# EAGLE design chest_03_12_2018 (EAGLE 6.6.0)
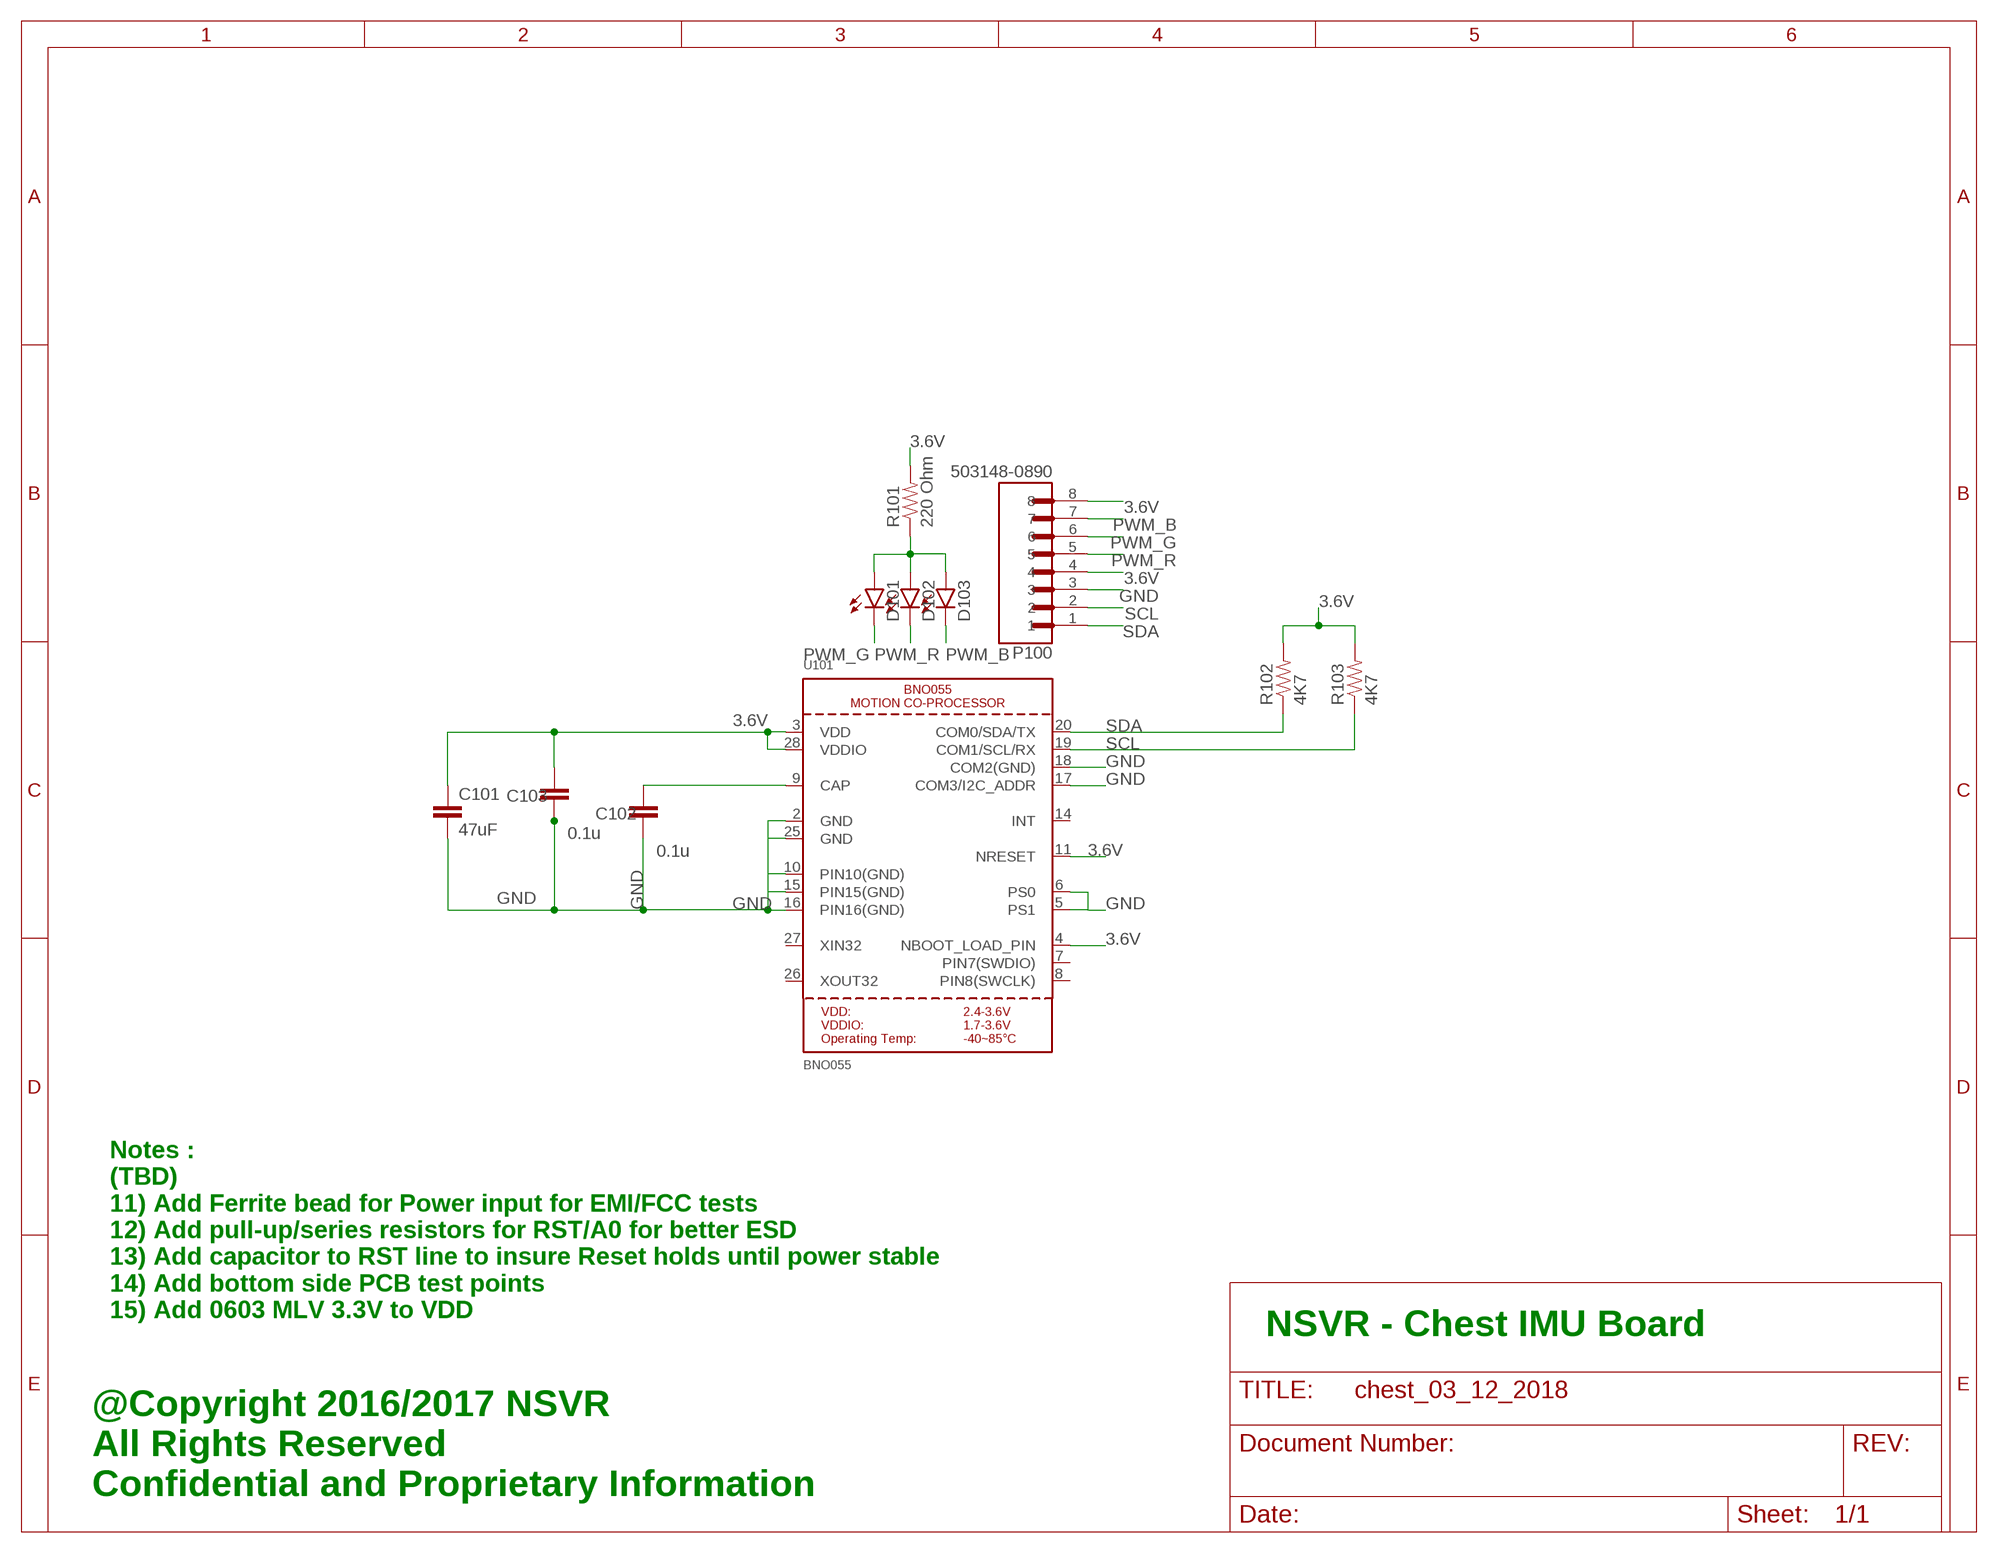
[diagram p0: schematic, sheet 1]

## Parts
C101  47uF  CAP1206  [1206]
C102  0.1u  CAP0402-CAP  [0402-CAP]
C103  0.1u  CAP0402-CAP  [0402-CAP]
D101  LED0603  [LED-0603]
D102  LED0603  [LED-0603]
D103  LED0603  [LED-0603]
P100  503148-0890  [MOLEX_503148-0890]
R101  220 Ohm  RESISTOR0402-TYP  [EIA-0402]
R102  4K7  RESISTOR0402-TYP  [EIA-0402]
R103  4K7  RESISTOR0402-TYP  [EIA-0402]
U101  BNO055  [BNO055]

## Nets
3.6V: C101.1 C103.1 P100.4 P100.8 R101.2 R102.2 R103.2 U101.3(VDD) U101.4(NBOOT_LOAD_PIN) U101.11(NRESET) U101.28(VDDIO)
BYPASS: C102.1 U101.9(CAP)
GND: C101.2 C102.2 C103.2 P100.3 U101.2(GND) U101.5(PS1) U101.6(PS0) U101.10(PIN10(GND)) U101.15(PIN15(GND)) U101.16(PIN16(GND)) U101.17(COM3/I2C_ADDR) U101.18(COM2(GND)) U101.25(GND)
N$1: D101.A D102.A D103.A R101.1
PWM_B: D103.C P100.7
PWM_G: D101.C P100.6
PWM_R: D102.C P100.5
SCL: P100.2 R103.1 U101.19(COM1/SCL/RX)
SDA: P100.1 R102.1 U101.20(COM0/SDA/TX)
Unconnected: U101.7(PIN7(SWDIO)) U101.8(PIN8(SWCLK)) U101.14(INT) U101.26(XOUT32) U101.27(XIN32)

## Notes on the sheet
- Notes :
  (TBD)
  11) Add Ferrite bead for Power input for EMI/FCC tests
  12) Add pull-up/series resistors for RST/A0 for better ESD
  13) Add capacitor to RST line to insure Reset holds until power stable
  14) Add bottom side PCB test points
  15) Add 0603 MLV 3.3V to VDD
- NSVR - Chest IMU Board
- @Copyright 2016/2017 NSVR
  All Rights Reserved
  Confidential and Proprietary Information

## Library data of the parts
C101-C103 = PatternAgents-ProtoPads:CAP: Capacitor Standard 0603 ceramic capacitor, and 0.1" leaded capacitor.
D101-D103 = SparkFun-LED:LED: LEDs Standard schematic elements and footprints for 5mm, 3mm, 1206, and 0603 sized LEDs. 5mm - Spark Fun Electronics SKU : COM-00529 (and others)
P100 = 503148-0890:503148-0890: 1.5wb Dual r/a Embs Tape Pkg 8p; AVAILABILITY: Good; DESCRIPTION: 1.5wb Dual r/a Embs Tape Pkg 8p; MF: Molex; MP: 503148-0890; PACKAGE: None; PRICE: 1.11 USD
R101-R103 = PatternAgents-ProtoPads:RESISTOR: Resistor Basic schematic elements and footprints for 0603, 1206, and PTH resistors.
U101 = microbuilder:BNO055: BNO055 - Motion Co-Processor

## Board
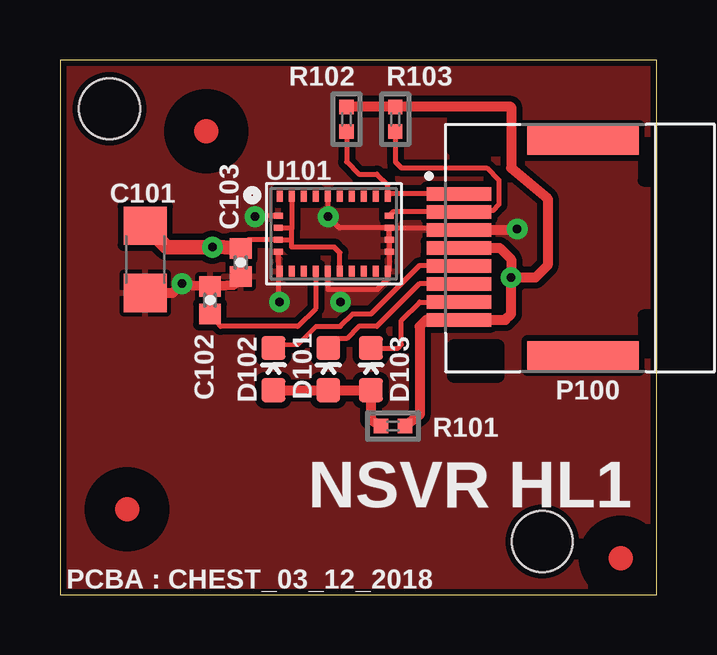
[diagram p1: board, top side]
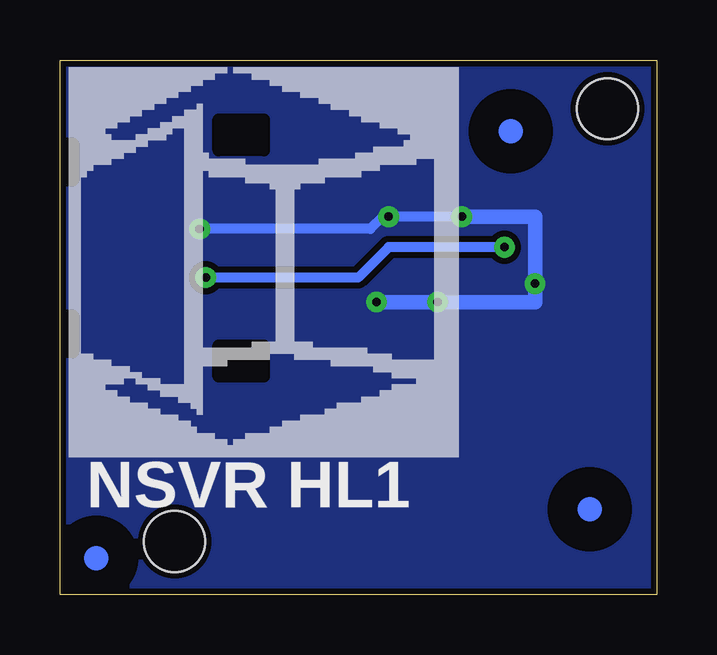
[diagram p2: board, bottom side, seen from below]

Size 24.87 x 22.28 mm. Coordinates in mm from the lower left corner, seen from the top.
Outline: 0,0 24.87,0 24.87,22.28 0,22.28 0,0
Copper layers (1*16): Top 0.035mm / dielectric 1.5mm / Bottom 0.035mm
Design rules "PatternAgents_7mil": minimum track width 7mil, minimum drill 14mil, track to track 7mil, track to pad 7mil, pad to pad 7mil, via to via 7mil, smd to smd 7mil, copper to edge 7mil, drill to drill 7mil, minimum pad ring 12mil, minimum via ring 10mil, stop-mask expansion 4mil, vias tented up to drill 25mil, thermal gap 7mil
Holes 2.54 mm at 2.06,20.25 20.1,2.21

### Footprints (pad centres in the part's own frame; a part is rotated, then mirrored left to right if it is on the bottom)
1206 = smd 1.6 x 1.8: 1 -1.4,0; 2 1.4,0
0402-CAP = smd 0.85 x 0.9: 1 -0.58,0; 2 0.58,0
LED-0603 = smd 1 x 1: A 0,-0.877; C 0,0.877
MOLEX_503148-0890 = smd 0.55 x 2.7: 1 2.25,0; 2 1.5,0; 3 0.75,0; 4 0,0; 5 -0.75,0; 6 -1.5,0; 7 -2.25,0; 8 -3,0 | smd 1.2 x 4.65: P1 -4.48,-5.175; P2 4.48,-5.175
EIA-0402 = smd 0.6 x 0.6: 1 -0.508,0; 2 0.508,0
BNO055 = smd 0.25 x 0.475: 1 -2.25,1.562; 6 -2.25,-1.562; 7 -1.75,-1.562; 8 -1.25,-1.562; 9 -0.75,-1.562; 10 -0.25,-1.562; 11 0.25,-1.562; 12 0.75,-1.562; 13 1.25,-1.562; 14 1.75,-1.562; 15 2.25,-1.562; 20 2.25,1.562; 21 1.75,1.562; 22 1.25,1.562; 23 0.75,1.562; 24 0.25,1.562; 25 -0.25,1.562; 26 -0.75,1.562; 27 -1.25,1.562; 28 -1.75,1.562 | smd 0.375 x 0.25: 2 -2.312,0.75; 3 -2.312,0.25; 4 -2.312,-0.25; 5 -2.312,-0.75; 16 2.312,-0.75; 17 2.312,-0.25; 18 2.312,0.25; 19 2.312,0.75

### Placement (x,y rotation side)
C101  3.56,13.97 270 top
C102  6.25,12.27 90 top
C103  7.53,13.84 270 top
D101  11.18,9.4 0 top
D102  8.89,9.4 0 top
D103  12.95,9.4 0 top
P100  16.62,14.45 90 top
R101  13.88,7.02 0 top
R102  11.94,19.81 90 top
R103  13.97,19.81 90 top
U101  11.41,15.03 0 top
U$1  [CIRCLE-1MM-3R]  6.1,19.3 0 top
U$2  [NSVR_LOGO]  24.38,5.84 0 bottom
U$3  [CIRCLE-1MM-3R]  23.37,1.52 0 top
U$4  [CIRCLE-1MM-3R]  2.79,3.56 0 top

### Tracks (layer width: path | path; a pad name or v marks a point on that pad's centre or on a via)
3.6V  (via drill 0.36)
  Top 0.203: C103.1 7.83,14.79 U101.4 9.6,14.79 9.65,14.73 | U101.28 9.66,15.25 9.65,15.24 | U101.11 11.66,14.25 11.43,14.48 9.65,14.48 9.65,14.73 | U101.3 9.61,15.29 9.65,15.24 | 9.65,14.73 9.65,15.24
  Top 0.406: 6.61,14.49 v6.35,14.48 | v18.8,13.21 18.8,11.68 18.56,11.45 P100.8 15.26,11.45 14.99,11.18 14.99,7.49 R101.2 | P100.4 18.32,14.45 18.8,13.97 v18.8,13.21 | v18.8,13.21 19.81,13.21 20.32,13.72 20.32,16.51 18.8,17.78 18.8,20.32 R103.2 R102.2
  Top 0.61: C103.1 6.61,14.49 | v6.35,14.48 4.45,14.48 C101.1
  Bottom 0.406: v6.35,14.48 11.18,14.48 12.45,13.21 v18.8,13.21
BYPASS
  Top 0.203: U101.9 10.67,11.94 9.91,11.18 6.69,11.18 C102.1
GND  (via drill 0.36)
  Top 0.178: 13.69,14.22 U101.16 | U101.16 | U101.16 13.69,14.4 13.72,14.36 | 13.34,15.29
  Top 0.203: U101.2 8.16,15.79 v8.13,15.75 | U101.25 11.18,16.58 v11.18,15.75 11.64,15.29 U101.18 | U101.5 9.1,13.54 | 9.1,13.54 U101.6 | 16.53,15.29 P100.3 | U101.10 11.16,12.72 13.22,12.72 13.66,13.15 U101.15 13.72,13.54 U101.16 U101.17 U101.18 | 11.68,12.7 v11.68,12.19 | U101.18 16.72,15.29 16.76,15.24 | 9.1,13.54 9.1,12.24 v9.14,12.19
  Top 0.406: C102.2 7.26,12.92 C103.2 | 5.12,12.92 C102.2 | C101.2 4.7,12.57 v5.08,12.95 | C102.2 6.31,12.92 6.35,12.95 | P100.3 19,15.2 v19.05,15.24
  Bottom 0.406: v8.13,15.75 v11.18,15.75 11.43,15.75 11.94,15.24 v19.05,15.24
  Bottom 0.61: v8.13,15.75 5.08,15.75 v5.08,12.95 5.08,12.19 v9.14,12.19 v11.68,12.19
  pour Bottom (isolate 0.254): 0,22.35 24.89,22.35 24.89,0 0,0
  pour Top (isolate 0.254): 0,22.35 24.89,22.35 24.89,0 0,0
N$1
  Top 0.406: D102.A D101.A D103.A 12.95,7.29 R101.1
PWM_B
  Top 0.203: D103.C 14.09,10.28 14.22,10.41 14.22,11.43 14.99,12.19 P100.7
PWM_G
  Top 0.203: P100.6 14.98,12.95 13.21,11.18 12.45,11.18 11.94,10.67 11.57,10.67 D101.C
PWM_R
  Top 0.178: 10.67,11.18 9.91,10.41 9.03,10.41 D102.C
  Top 0.203: P100.5 14.96,13.7 12.95,11.68 12.19,11.68 11.68,11.18 10.67,11.18 | D102.C 9.03,10.16 9.14,10.16
SCL
  Top 0.203: U101.19 13.88,15.95 P100.2 16.68,16 18.03,16 18.29,16.26 18.29,17.27 17.78,17.78 14.22,17.78 13.97,18.03 R103.1
SDA
  Top 0.203: P100.1 13.76,16.7 U101.20 13.66,17.07 13.21,17.53 12.45,17.53 11.94,18.03 R102.1

### Text on the board
tPlace: PCBA : CHEST_03_12_2018
tNames: NSVR HL1
bNames: NSVR HL1